# Altium schematic sheet Backside.SchDoc
size A4; DocumentNumber: 3; SheetNumber: 3; SheetTotal: 4; RelSerie: X
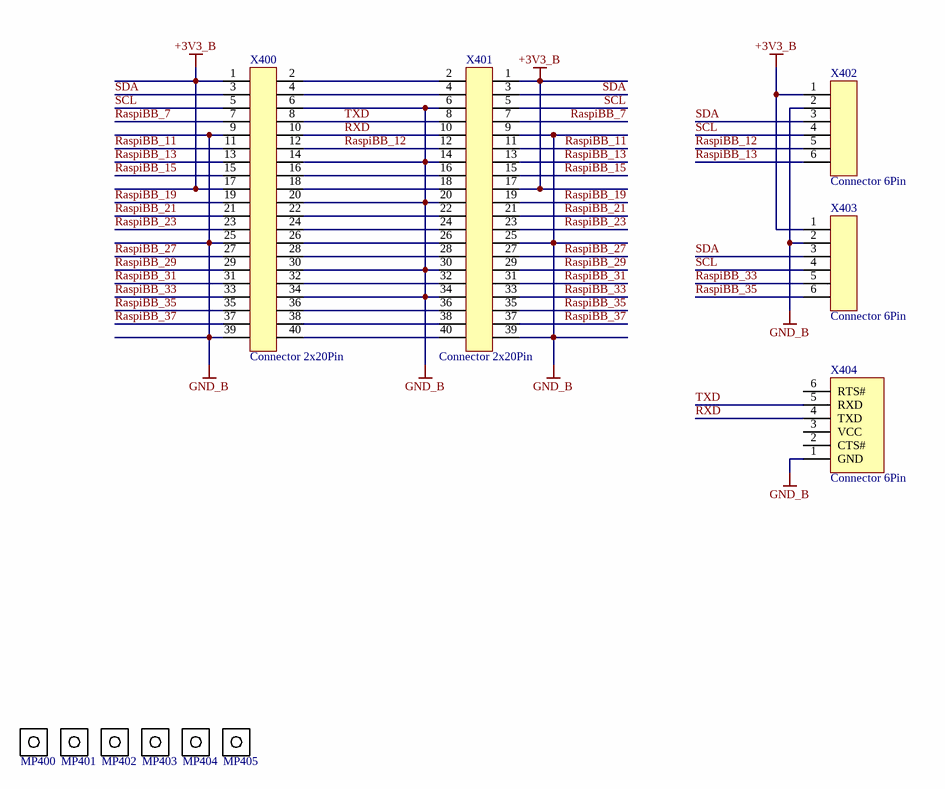
[diagram p0: Backside.SchDoc]

## Parts
MP400  Mounting Hole  [M2 2.3]  (value not drawn)  (no BOM)
MP401  Mounting Hole  [M2 2.3]  (value not drawn)  (no BOM)
MP402  Mounting Hole  [M2 2.3]  (value not drawn)  (no BOM)
MP403  Mounting Hole  [M2 2.3]  (value not drawn)  (no BOM)
MP404  Mounting Hole  [M2 2.3]  (value not drawn)  (no BOM)
MP405  Mounting Hole  [M2 2.3]  (value not drawn)  (no BOM)
X400  Connector 2x20Pin  [Pin Header 2x20 TH Pitch 2.54mm - sh]
X401  Connector 2x20Pin  [Pin Header 2x20 TH Pitch 2.54mm - sh]
X402  Connector 6Pin  [Pin Header 2x3 TH Pitch 2.54mm f]
X403  Connector 6Pin  [Pin Header 2x3 TH Pitch 2.54mm f]
X404  Connector 6Pin  [Pin Header 1x6 TH Pitch 2.54mm]

## Nets
+3V3_B: X400.1 X400.17 X401.1 X401.17 X402.1 X403.1
GND_B: X400.6 X400.9 X400.14 X400.20 X400.25 X400.30 X400.34 X400.39 X401.6 X401.9 X401.14 X401.20 X401.25 X401.30 X401.34 X401.39 X402.2 X403.2 X404.1(GND)
RaspiBB_7: X400.7 X401.7
RaspiBB_11: X400.11 X401.11
RaspiBB_12: X400.12 X401.12 X402.5
RaspiBB_13: X400.13 X401.13 X402.6
RaspiBB_15: X400.15 X401.15
RaspiBB_19: X400.19 X401.19
RaspiBB_21: X400.21 X401.21
RaspiBB_23: X400.23 X401.23
RaspiBB_27: X400.27 X401.27
RaspiBB_29: X400.29 X401.29
RaspiBB_31: X400.31 X401.31
RaspiBB_33: X400.33 X401.33 X403.5
RaspiBB_35: X400.35 X401.35 X403.6
RaspiBB_37: X400.37 X401.37
RXD: X400.10 X401.10 X404.4(TXD)
SCL: X400.5 X401.5 X402.4 X403.4
SDA: X400.3 X401.3 X402.3 X403.3
TXD: X400.8 X401.8 X404.5(RXD)
NetX400_2: X400.2 X401.2
NetX400_4: X400.4 X401.4
NetX400_16: X400.16 X401.16
NetX400_18: X400.18 X401.18
NetX400_22: X400.22 X401.22
NetX400_24: X400.24 X401.24
NetX400_26: X400.26 X401.26
NetX400_28: X400.28 X401.28
NetX400_32: X400.32 X401.32
NetX400_36: X400.36 X401.36
NetX400_38: X400.38 X401.38
NetX400_40: X400.40 X401.40

Not connected (* = marked no-connect by the designer): X404 2(CTS#) 3(VCC) 6(RTS#)

## Notes on the sheet
- Bezeichnung:
- Printnummer:
- Filename:
- Format:
- Blatt:
- Erstellt:
- Erst. Datum:
- Freigegeben:
- Serie
- Prototyp
- Entwicklung
- A4
- Nummer:
- Geprüft
- Geprüft Datum:
- Index:

## Library data of the parts
MP400-MP405 = MP_Mounting Hole: Different Mounting holes
X400 X401 = X_Connector 2x20Pin: Generic connector 2x20 Pin
X402 X403 = X_Connector 6Pin: Generic connector 6 Pin
X404 = X_Connector FTDI cable: Connector 6 Pin for FTDI cable; Manufacturer: Mill-Max; Manufacturer Part Number: 419-10-206-00-006000; Number of Contacts: 6; Pitch: 0.1inch; Supplier 1: Digi-Key; Supplier Part Number 1: ED1376-ND; Stock 1: 291; Pricing 1: 1=4.33, 10=4.152, 100=3.46, 500=2.941, 1000=2.5085 (USD); Mount: Through Hole; Material: Brass; Contact Plating: Gold; Packaging: Bulk; Number of Rows: 2; Row Spacing: 0.1inch; ComponentLink1URL: https://www.mill-max.com/assets/pdfs/021.2.PDF; ComponentLink1Description: https://www.mill-max.com/assets/pdfs/021.2.PDF